# EAGLE design tip120_controller (EAGLE 9.0.1)
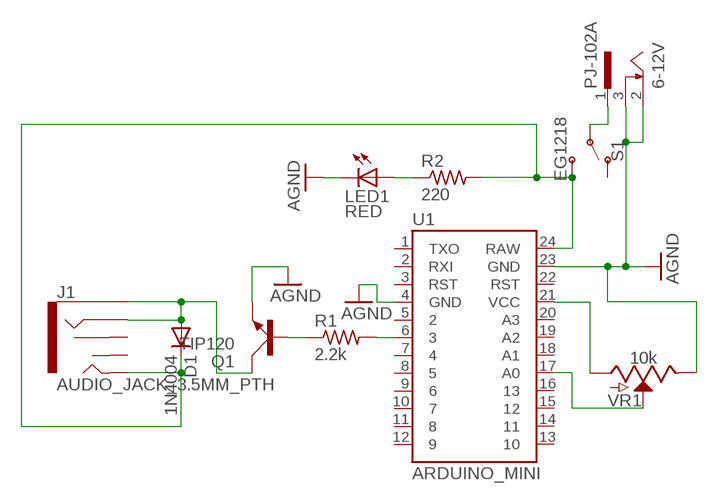
[diagram p0: schematic, sheet 1]

## Parts
D1  1N4004  [DO41-10]
J1  AUDIO_JACK_3.5MM_PTH  [AUDIO-JACK]
LED1  RED  LED5MM  [LED5MM]
PJ-102A  6-12V  SCD-014A  [SCD-014-A]
Q1  TIP120  TIP41C  [TO220AV]
R1  2.2k  R-US_0204/2V  [0204V]
R2  220  R-US_0204/2V  [0204V]
S1  EG1218  SWITCH-SPDT-PTH-11.6X4.0MM-LOCK  [SWITCH_SPDT_PTH_11.6X4.0MM_LOCK]
U1  ARDUINO_MINI  [ARDUINO_MINI]
VR1  10k  POTENTIOMETER-PTH-9MM-1/20W-20%  [POT-PTH-ALPS]

## Nets
AGND: LED1.K(C) PJ-102A.2 PJ-102A.3 Q1.E U1.4(GND) U1.23(GND) VR1.P$1(E)
N$1: R1.2 U1.6
N$2: Q1.B R1.1
N$3: LED1.A R2.1
N$4: D1.A J1.RING J1.SLEEVE Q1.C
N$5: U1.21(VCC) VR1.P$3(A)
N$6: U1.17(A0) VR1.P$2(S)
N$7: PJ-102A.1 S1.2(P)
N$8: D1.C J1.TIP R2.2 S1.3(S) U1.24(RAW)
Unconnected: J1.RSH J1.TSH S1.1(O) U1.1(TXO) U1.2(RXI) U1.3(RST) U1.5 U1.7 U1.8 U1.9 U1.10 U1.11 U1.12 U1.13 U1.14 U1.15 U1.16 U1.18(A1) U1.19(A2) U1.20(A3) U1.22(RST)

## Library data of the parts
D1 = diode:1N4004: DIODE general purpose rectifier, 1 A
J1 = SparkFun-Connectors:AUDIO_JACK_3.5MM: Audio Jack 3.5mm variants of PTH and SMT stereo audio jack with bypass switches. SparkFun Products: SparkFun SparkPunk Sound Kit <[https://www.sparkfun.com/products/11177]> - PTH MP3 Trigger <https://www.sparkfun.com/products/13720> -3.5mm SMD SparkFun PicoBoard <https://www.sparkfun.com/products/11888>- 2.5mm SMD; PROD_ID: CONN-08774; SF_ID: PRT-08032
LED1 = led:LED: LED OSRAM: - CHIPLED LG R971, LG N971, LY N971, LG Q971, LY Q971, LO R971, LY R971 LH N974, LH R974 LS Q976, LO Q976, LY Q976 LO Q996 - Hyper CHIPLED LW Q18S LB Q993, LB Q99A, LB R99A - SideLED LS A670, LO A670, LY A670, LG A670, LP A670 LB A673, LV A673, LT A673, LW A673 LH A674 LY A675 LS A676, LA A676, LO A676, LY A676, LW A676 LS A679, LY A679, LG A679 - Hyper Micro SIDELED® LS Y876, LA Y876, LO Y876, LY Y876 LT Y87S - SmartLED LW L88C, LW L88S LB L89C, LB L89S, LG L890 LS L89K, LO L89K, LY L89K LS L896, LA L896, LO L896, LY L896 - TOPLED LS T670, LO T670, LY T670, LG T670, LP T670 LSG T670, LSP T670, LSY T670, LOP T670, LYG T670 LG T671, LOG T671, LSG T671 LB T673, LV T673, LT T673, LW T673 LH T674 LS T676, LA T676, LO T676, LY T676, LB T676, LH T676, LSB T676, LW T676 LB T67C, LV T67C, LT T67C, LS T67K, LO T67K, LY T67K, LW E67C LS E67B, LA E67B, LO E67B, LY E67B, LB E67C, LV E67C, LT E67C LW T67C LS T679, LY T679, LG T679 LS T770, LO T770, LY T770, LG T770, LP T770 LB T773, LV T773, LT T773, LW T773 LH T774 LS E675, LA E675, LY E675, LS T675 LS T776, LA T776, LO T776, LY T776, LB T776 LHGB T686 LT T68C, LB T68C - Hyper Mini TOPLED® LB M676 - Mini TOPLED Santana® LG M470 LS M47K, LO M47K, LY M47K Source: http://www.osram.convergy.de LUXEON: - LUMILED® LXK2-PW12-R00, LXK2-PW12-S00, LXK2-PW14-U00, LXK2-PW14-V00 LXK2-PM12-R00, LXK2-PM12-S00, LXK2-PM14-U00 LXK2-PE12-Q00, LXK2-PE12-R00, LXK2-PE12-S00, LXK2-PE14-T00, LXK2-PE14-U00 LXK2-PB12-K00, LXK2-PB12-L00, LXK2-PB12-M00, LXK2-PB14-N00, LXK2-PB14-P00, LXK2-PB14-Q00 LXK2-PR12-L00, LXK2-PR12-M00, LXK2-PR14-Q00, LXK2-PR14-R00 LXK2-PD12-Q00, LXK2-PD12-R00, LXK2-PD12-S00 LXK2-PH12-R00, LXK2-PH12-S00 LXK2-PL12-P00, LXK2-PL12-Q00, LXK2-PL12-R00 Source: www.luxeon.com KINGBRIGHT: KA-3528ASYC Source: www.kingbright.com
PJ-102A = con-shiua-chyuan:SCD-014A: Power Jack 2.5mm; OC_FARNELL: unknown; OC_NEWARK: unknown
Q1 = transistor-power:TIP41C: NPN TRANSISTOR
R1 R2 = resistor:R-US_: RESISTOR, American symbol
S1 = SparkFun-Switches:SWITCH-SPDT: Single Pole, Double Throw (SPDT) Switch Single-pole, double-throw (SPDT) switch. Variant Overview SMD-AYZ0202 Surface Mount DPDT Switch <https://www.sparkfun.com/products/597> (COM-00597) Used on e.g. LilyPad Arduino USB - ATmega32U4 Board <https://www.sparkfun.com/products/12049> PTH-11.6X4.0MM SPDT Mini Power Switch <https://www.sparkfun.com/products/102> (COM-00102) Used on e.g. SparkFun Simon Says - Through-Hole Soldering Kit <https://www.sparkfun.com/products/10547> (KIT-10547) PTH-11.6X4.0MM-KIT KIT version of SPDT Mini Power Switch - Simplifies soldering by removing tStop of switch pins - only one side can be soldered. PTH-11.6X4.0MM-LOCK LOCK version of SPDT Mini Power Switch - Offset pins hold switch in place for easier soldering. SMD-RIGHT-ANGLE Surface Mount Right Angle Switch <https://www.sparkfun.com/products/10860> (COM-10860) Used on e.g. SparkFun ESP8266 Thing <https://www.sparkfun.com/products/13231>; PROD_ID: SWCH-08261; SF_SKU: COM-00102
U1 = SparkFun-Boards:ARDUINO_MINI: Arduino Pro Mini footprint
VR1 = SparkFun-Resistors:POTENTIOMETER: Potentiometer (Pot) Three-terminal potentiometers, with an adjustable wiper and two adjustable resistors. A pot can be used to create a configurable voltage divider, or as a variable resistor. Variants ALPS_POT and ALPS_POT_KIT - PTH, breadboard compatible, 9mm square pots Rotary Potentiometer - Linear (10k ohm) <https://www.sparkfun.com/products/9288> (COM-09288) The KIT variant exposes copper on only one side of the PTH pad, so the part can only be assembled on one side of the PCB. Useful for beginner soldering kits.; PROD_ID: RES-09177; SF_SKU: COM-09288

## Board
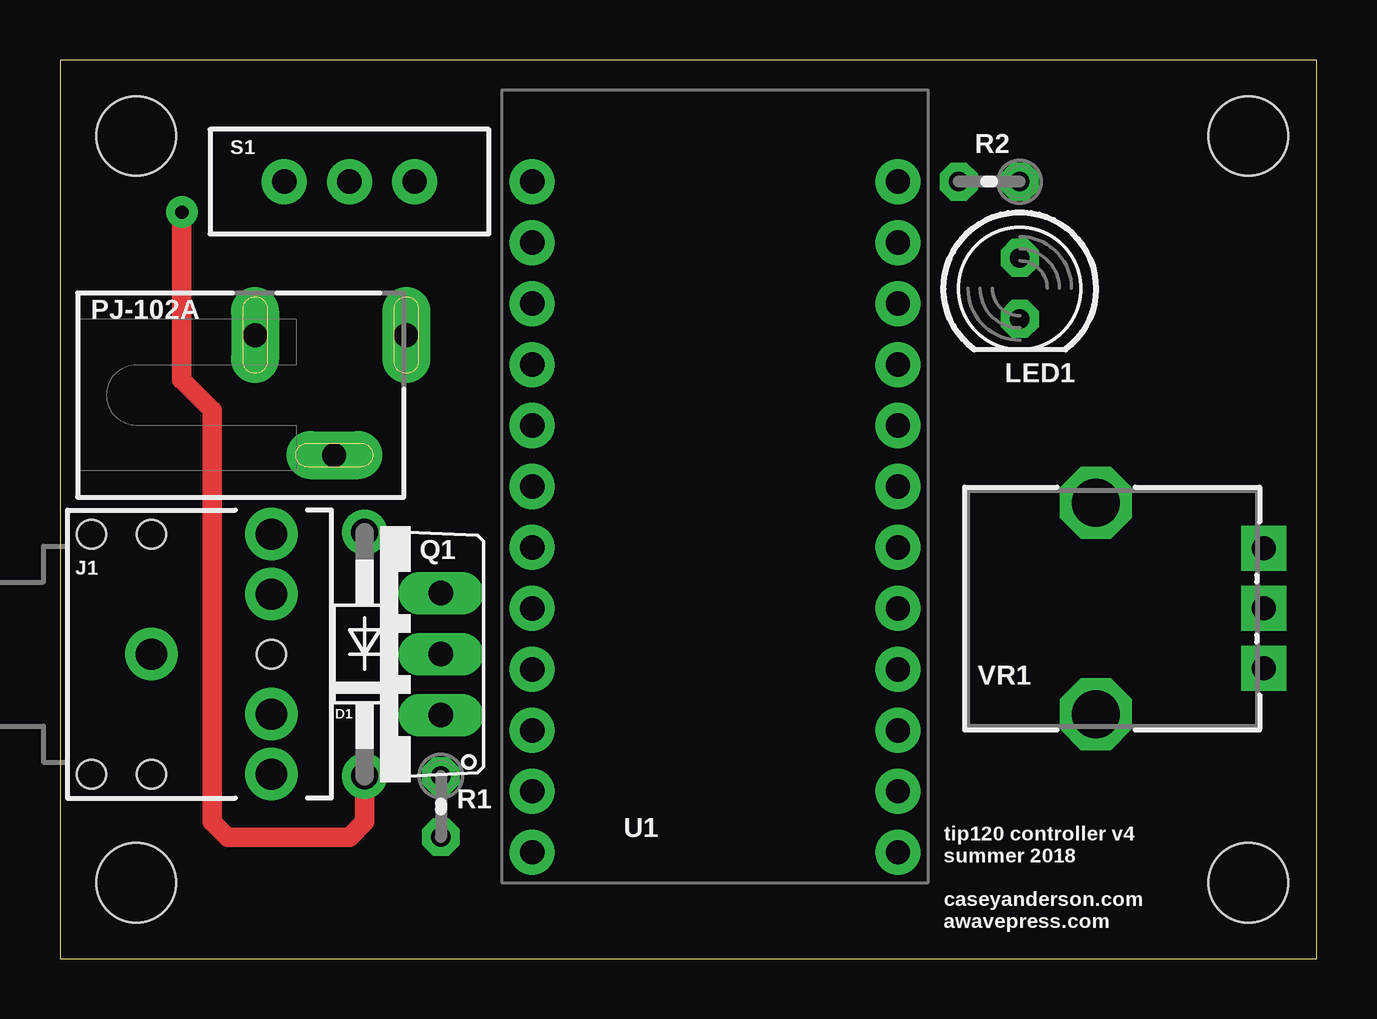
[diagram p1: board, top side]
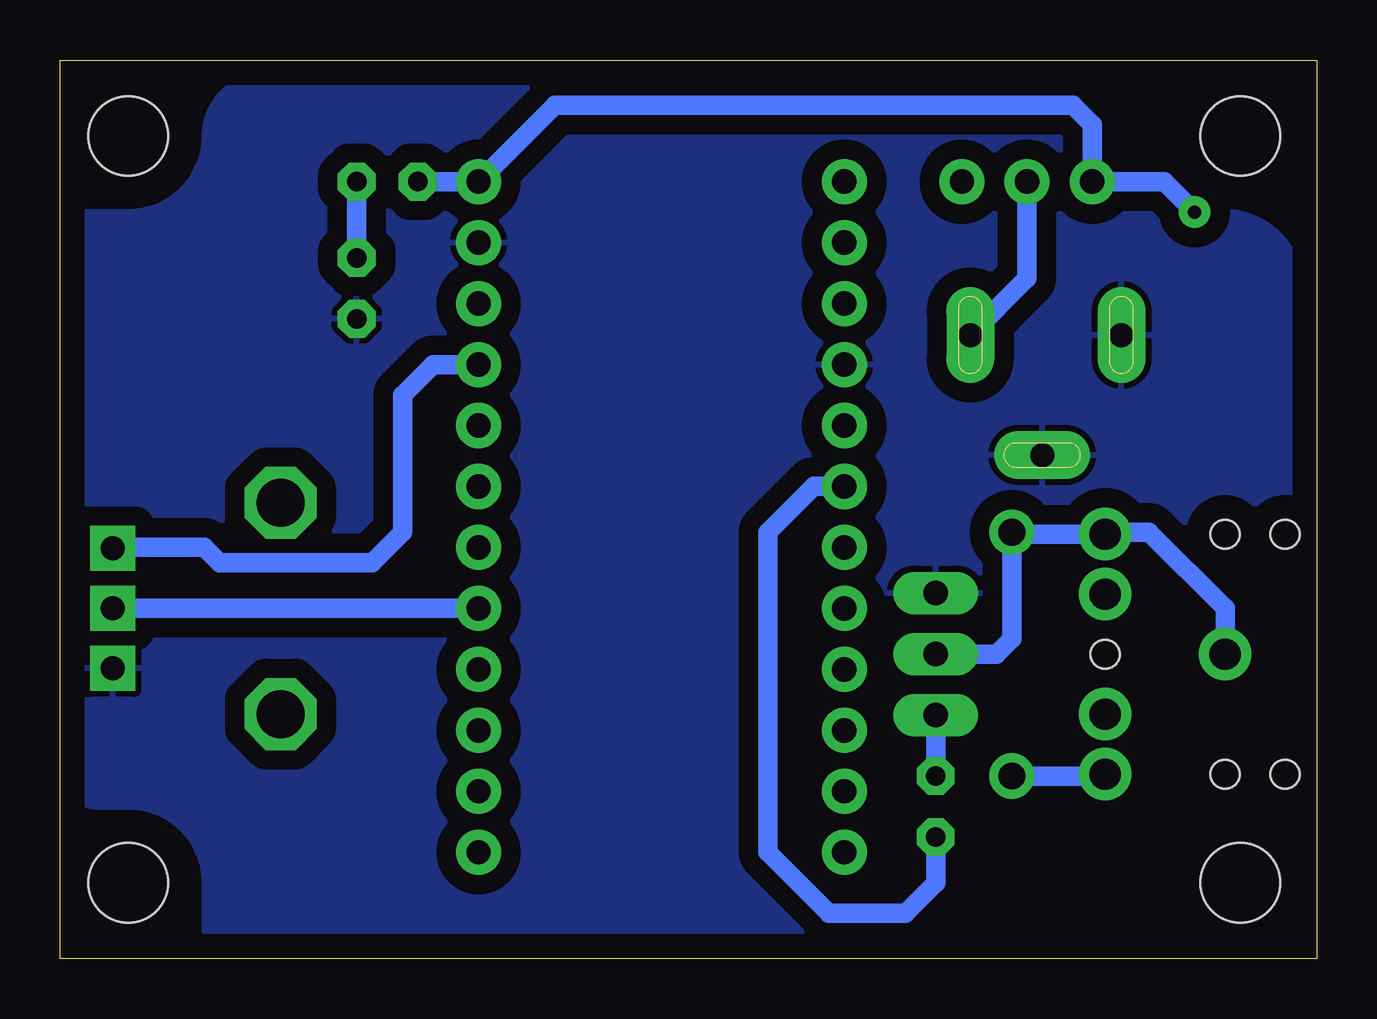
[diagram p2: board, bottom side, seen from below]

Size 52.38 x 37.46 mm. Coordinates in mm from the lower left corner, seen from the top.
Outline: 0,0 52.38,0 52.38,37.46 0,37.46 0,0
Copper layers (1*16): Top 0.035mm / dielectric 1.5mm / Bottom 0.035mm
Design rules "default *": minimum track width 10mil, minimum drill 24mil, track to track 8mil, track to pad 8mil, pad to pad 8mil, via to via 8mil, smd to smd 8mil, copper to edge 40mil, drill to drill 8mil, minimum pad ring 15mil, minimum via ring 15mil, stop-mask expansion 4mil, vias tented up to drill 0mil, thermal gap 10mil

### Footprints (pad centres in the part's own frame; a part is rotated, then mirrored left to right if it is on the bottom)
DO41-10 = drill 1.118: A 5.08,0; C -5.08,0
AUDIO-JACK = drill 1.3 pad 2.184: RING 5,5; RSH 5,2.5; SLEEVE 0,0; TIP 5,-5; TSH 5,-2.5 | hole 1.2: 0,5; -2.5,5; -2.5,-5; 0,-5; 5,0
LED5MM = drill 0.813 octagon: A -1.27,0; K 1.27,0
SCD-014-A = drill 1 pad 2 long: 1 -2.5,13.8; 2 -2.5,7.5; 3 2.5,10.8
TO220AV = drill 1.016 long: B -2.54,-2.54; C 0,-2.54; E 2.54,-2.54
0204V = drill 0.813 octagon: 1 -1.27,0; 2 1.27,0
SWITCH_SPDT_PTH_11.6X4.0MM_LOCK = drill 1.016 pad 1.88: 1 0,2.718; 2 0,0; 3 0,-2.718
ARDUINO_MINI = drill 1.016 pad 1.88: 1 -7.62,12.7; 2 -7.62,10.16; 3 -7.62,7.62; 4 -7.62,5.08; 5 -7.62,2.54; 6 -7.62,0; 7 -7.62,-2.54; 8 -7.62,-5.08; 9 -7.62,-7.62; 10 -7.62,-10.16; 11 -7.62,-12.7; 12 -7.62,-15.24; 13 7.62,-15.24; 14 7.62,-12.7; 15 7.62,-10.16; 16 7.62,-7.62; 17 7.62,-5.08; 18 7.62,-2.54; 19 7.62,0; 20 7.62,2.54; 21 7.62,5.08; 22 7.62,7.62; 23 7.62,10.16; 24 7.62,12.7
STAND-OFF = hole 3.302: 0,0
POT-PTH-ALPS = drill 1 pad 1.88 square: P$1 7,-2.5; P$2 7,0; P$3 7,2.5 | drill 2 octagon: P$4 0,-4.4; P$5 0,4.4

### Placement (x,y rotation side)
D1  12.7,12.7 90 top
J1  3.81,12.7 0 top
LED1  40,27.94 270 top
PJ-102A  0.64,23.49 270 top
Q1  13.33,12.7 90 top
R1  15.88,6.35 270 top
R2  38.73,32.38 180 top
S1  12.06,32.38 270 top
U1  27.31,19.69 0 top
U$6  [STAND-OFF]  3.17,3.18 0 top
U$7  [STAND-OFF]  49.53,3.18 0 top
U$8  [STAND-OFF]  49.53,34.29 0 top
U$9  [STAND-OFF]  3.17,34.29 0 top
VR1  43.18,14.61 0 top

### Tracks (layer width: path | path; a pad name or v marks a point on that pad's centre or on a via)
AGND
  pour Bottom (isolate 0.813): 6.35,36.83 43.81,36.83 arc-90 46.35,34.29 arc90 49.53,31.12 51.43,31.12 arc-90 52.07,30.48 52.07,7.62 arc-90 50.8,6.35 49.53,6.35 arc90 46.35,3.18 46.35,1.27 arc-90 45.72,0.64 7.62,0.64 arc-90 6.35,1.91 6.35,3.18 arc90 3.17,6.35 1.27,6.35 arc-90 0.64,6.99 0.64,27.94 arc-90 3.81,31.12 arc90 6.35,33.66 6.35,36.2
N$1
  Bottom 0.813: U1.6 20.96,19.69 22.86,17.78 22.86,4.45 20.32,1.91 17.15,1.91 15.88,3.18 R1.2
N$2
  Bottom 0.813: R1.1 Q1.B
N$3
  Bottom 0.813: R2.1 LED1.A
N$4
  Bottom 0.813: J1.SLEEVE 3.81,14.61 6.98,17.78 8.73,17.78 J1.RING 12.62,17.7 D1.A 12.7,13.34 13.33,12.7 Q1.C
N$5
  Bottom 0.813: U1.21 36.83,24.77 38.1,23.49 38.1,17.78 39.37,16.51 45.72,16.51 46.35,17.15 50.14,17.15 VR1.P$3
N$6
  Bottom 0.813: VR1.P$2 U1.17
N$7
  Bottom 0.813: S1.2 12.06,28.37 PJ-102A.1
N$8  (via drill 0.55 pad 0.35)
  Top 0.813: D1.C 12.7,5.72 12.06,5.08 6.98,5.08 6.35,5.72 6.35,22.86 5.08,24.13 v5.08,31.12
  Bottom 0.813: R2.2 U1.24 31.75,35.56 10.16,35.56 9.35,34.75 S1.3 6.35,32.38 v5.08,31.12 | J1.TIP 8.89,7.62 D1.C

### Text on the board
tPlace: tip120 controller v4 / summer 2018 / / caseyanderson.com / awavepress.com